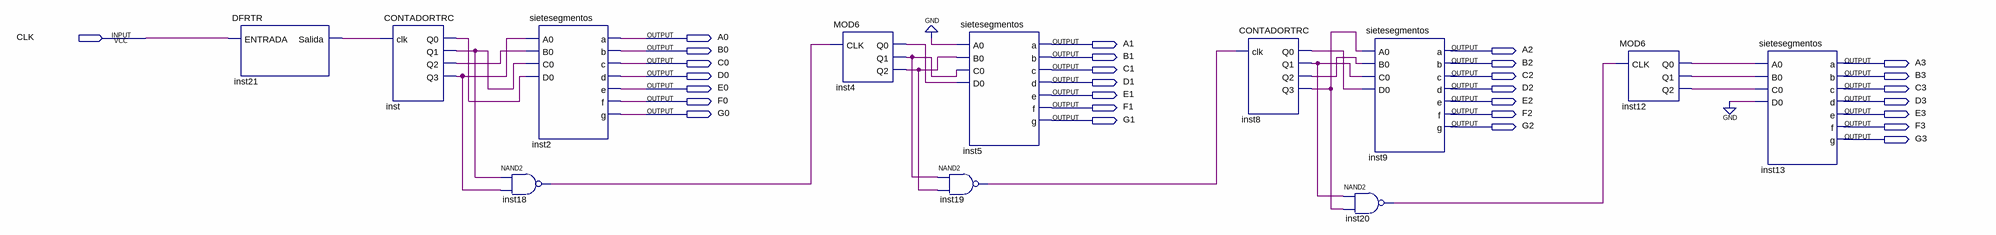
[diagram p0: schematic sheet]
// Quartus schematic RTR.bdf as structural Verilog: 12 symbols, 29 pins
module RTR (
  input  CLK,
  output A0,
  output A1,
  output B0,
  output A2,
  output B1,
  output C0,
  output B2,
  output A3,
  output C1,
  output D0,
  output C2,
  output B3,
  output D1,
  output E0,
  output D2,
  output C3,
  output E1,
  output F0,
  output E2,
  output D3,
  output F1,
  output G0,
  output F2,
  output E3,
  output G1,
  output G2,
  output F3,
  output G3
);

  wire inst4_q0, inst4_q1, inst4_q2, inst8_q0, inst8_q1, inst8_q2, inst8_q3, inst12_q0, inst12_q1, inst12_q2,
       inst18_out, inst19_out, inst20_out, inst21_salida, inst_q0, inst_q1, inst_q2, inst_q3;

  DFRTR inst21 (.ENTRADA(CLK), .Salida(inst21_salida));
  CONTADORTRC inst (.clk(inst21_salida), .Q0(inst_q0), .Q1(inst_q1), .Q2(inst_q2), .Q3(inst_q3));
  sietesegmentos inst2 (
    .A0(inst_q3), .B0(inst_q2), .C0(inst_q1), .D0(inst_q0), .a(A0), .b(B0), .c(C0), .d(D0), .e(E0), .f(F0),
    .g(G0));
  nand inst18 (inst18_out, inst_q1, inst_q3);
  MOD6 inst4 (.CLK(inst18_out), .Q0(inst4_q0), .Q1(inst4_q1), .Q2(inst4_q2));
  nand inst19 (inst19_out, inst4_q1, inst4_q2);
  sietesegmentos inst5 (
    .A0(1'b0), .B0(inst4_q2), .C0(inst4_q1), .D0(inst4_q0), .a(A1), .b(B1), .c(C1), .d(D1), .e(E1), .f(F1),
    .g(G1));
  CONTADORTRC inst8 (.clk(inst19_out), .Q0(inst8_q0), .Q1(inst8_q1), .Q2(inst8_q2), .Q3(inst8_q3));
  nand inst20 (inst20_out, inst8_q1, inst8_q3);
  sietesegmentos inst9 (
    .A0(inst8_q3), .B0(inst8_q2), .C0(inst8_q1), .D0(inst8_q0), .a(A2), .b(B2), .c(C2), .d(D2), .e(E2),
    .f(F2), .g(G2));
  MOD6 inst12 (.CLK(inst20_out), .Q0(inst12_q0), .Q1(inst12_q1), .Q2(inst12_q2));
  sietesegmentos inst13 (
    .A0(inst12_q0), .B0(inst12_q1), .C0(inst12_q2), .D0(1'b0), .a(A3), .b(B3), .c(C3), .d(D3), .e(E3),
    .f(F3), .g(G3));
endmodule
